# EAGLE design CP2108 (EAGLE 7.2.0)
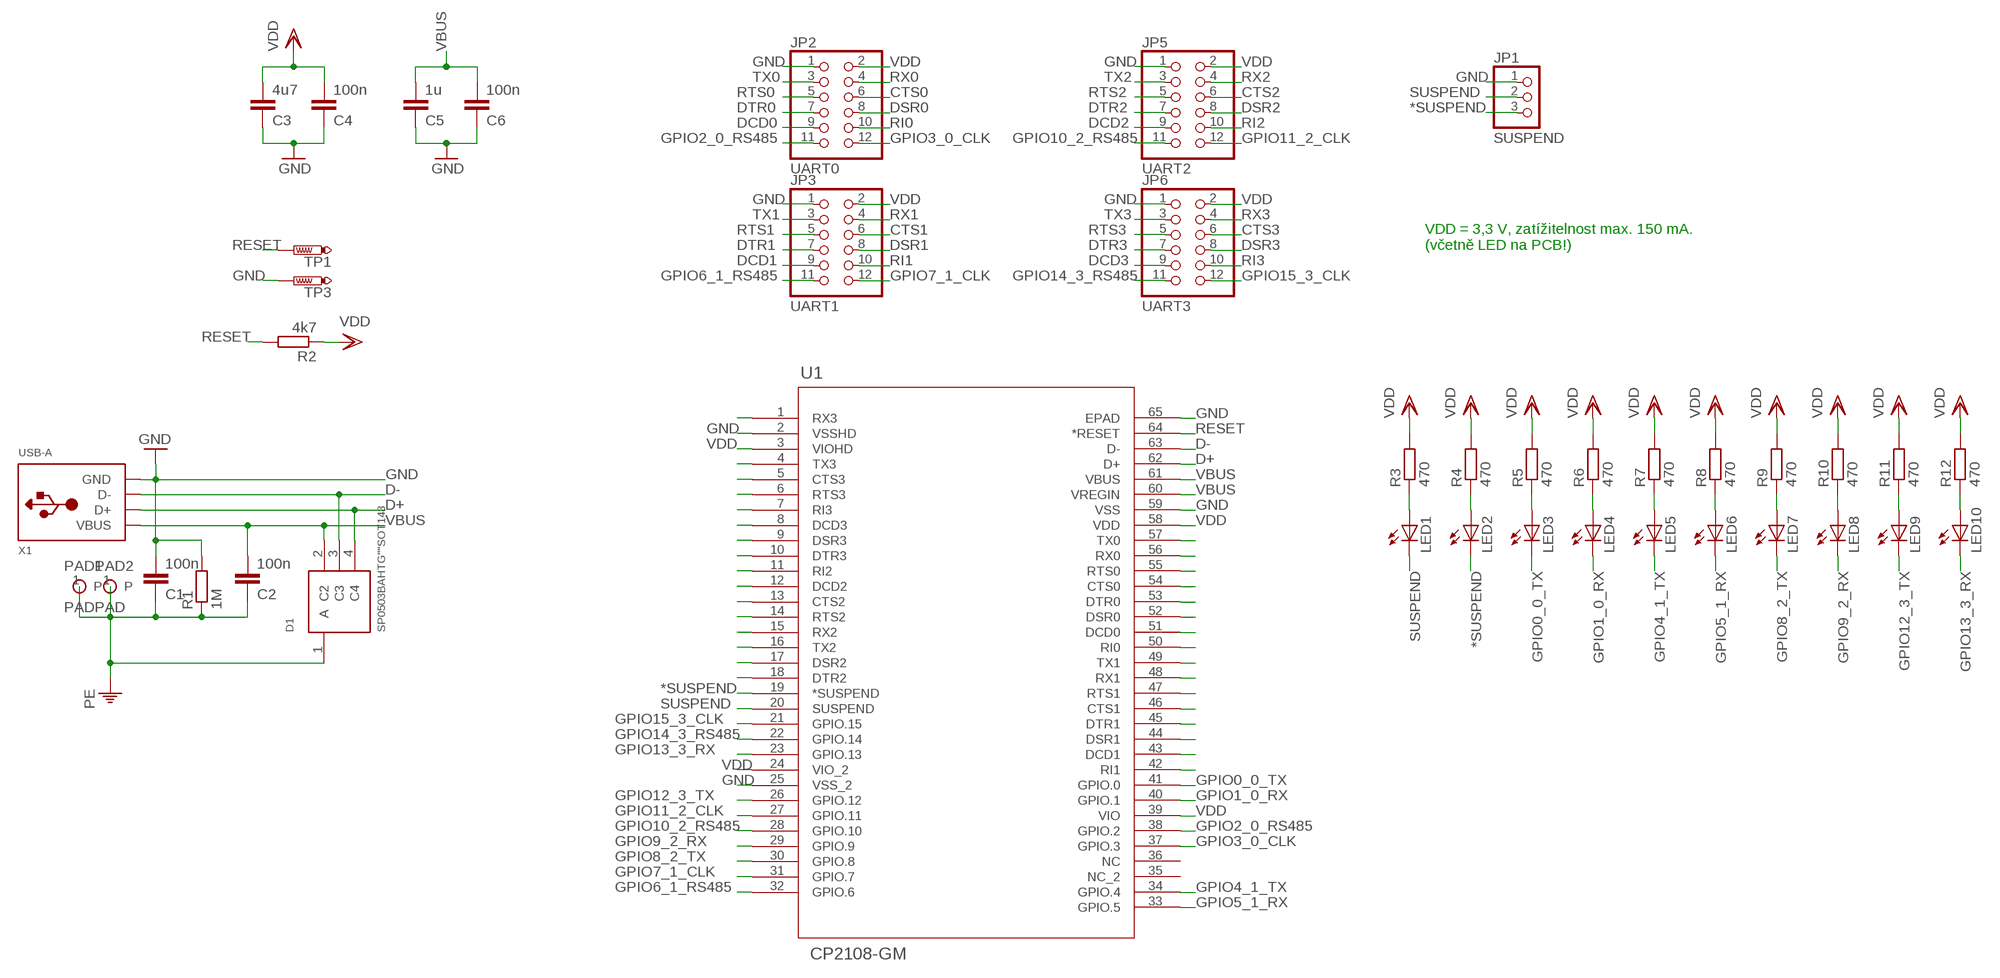
[diagram p0: schematic, sheet 1]

## Parts
C1  100n  C-EUC0603  [C0603]
C2  100n  C-EUC0603  [C0603]
C3  4u7  C-EUC0805  [C0805]
C4  100n  C-EUC0603  [C0603]
C5  1u  C-EUC0805  [C0805]
C6  100n  C-EUC0603  [C0603]
D1  SP0503BAHTG""SOT143  [SOT143]
JP1  SUSPEND  PINHD-1X3  [1X03]
JP2  UART0  PINHD-2X6  [2X06]
JP3  UART1  PINHD-2X6  [2X06]
JP5  UART2  PINHD-2X6  [2X06]
JP6  UART3  PINHD-2X6  [2X06]
LED1  LEDSML0603  [SML0603]
LED2  LEDSML0603  [SML0603]
LED3  LEDSML0603  [SML0603]
LED4  LEDSML0603  [SML0603]
LED5  LEDSML0603  [SML0603]
LED6  LEDSML0603  [SML0603]
LED7  LEDSML0603  [SML0603]
LED8  LEDSML0603  [SML0603]
LED9  LEDSML0603  [SML0603]
LED10  LEDSML0603  [SML0603]
PAD1  PAD  [PAD3]
PAD2  PAD  [PAD3]
R1  1M  R-EU_R0603  [R0603]
R2  4k7  R-EU_R0603  [R0603]
R3  470  R-EU_R0603  [R0603]
R4  470  R-EU_R0603  [R0603]
R5  470  R-EU_R0603  [R0603]
R6  470  R-EU_R0603  [R0603]
R7  470  R-EU_R0603  [R0603]
R8  470  R-EU_R0603  [R0603]
R9  470  R-EU_R0603  [R0603]
R10  470  R-EU_R0603  [R0603]
R11  470  R-EU_R0603  [R0603]
R12  470  R-EU_R0603  [R0603]
TP1  RESET  PTR1B1,27  [B1,27]
TP3  GND  PTR1B1,27  [B1,27]
U1  CP2108-GM  [QFN64]
X1  USB-A  [MOLEX_480371000]

## Nets
*SUSPEND: JP1.3 LED2.C U1.19(*SUSPEND)
CTS0: JP2.6 U1.54(CTS0)
CTS1: JP3.6 U1.46(CTS1)
CTS2: JP5.6 U1.13(CTS2)
CTS3: JP6.6 U1.5(CTS3)
D+: D1.4(C4) U1.62(D+) X1.3(D+)
D-: D1.3(C3) U1.63(D-) X1.2(D-)
DCD0: JP2.9 U1.51(DCD0)
DCD1: JP3.9 U1.43(DCD1)
DCD2: JP5.9 U1.12(DCD2)
DCD3: JP6.9 U1.8(DCD3)
DSR0: JP2.8 U1.52(DSR0)
DSR1: JP3.8 U1.44(DSR1)
DSR2: JP5.8 U1.17(DSR2)
DSR3: JP6.8 U1.9(DSR3)
DTR0: JP2.7 U1.53(DTR0)
DTR1: JP3.7 U1.45(DTR1)
DTR2: JP5.7 U1.18(DTR2)
DTR3: JP6.7 U1.10(DTR3)
GND: C1.2 C3.1 C4.1 C5.1 C6.1 JP1.1 JP2.1 JP3.1 JP5.1 JP6.1 R1.2 TP3.TP U1.2(VSSHD) U1.25(VSS_2) U1.59(VSS) U1.65(EPAD) X1.4(GND)
GPIO0_0_TX: LED3.C U1.41(GPIO.0)
GPIO1_0_RX: LED4.C U1.40(GPIO.1)
GPIO2_0_RS485: JP2.11 U1.38(GPIO.2)
GPIO3_0_CLK: JP2.12 U1.37(GPIO.3)
GPIO4_1_TX: LED5.C U1.34(GPIO.4)
GPIO5_1_RX: LED6.C U1.33(GPIO.5)
GPIO6_1_RS485: JP3.11 U1.32(GPIO.6)
GPIO7_1_CLK: JP3.12 U1.31(GPIO.7)
GPIO8_2_TX: LED7.C U1.30(GPIO.8)
GPIO9_2_RX: LED8.C U1.29(GPIO.9)
GPIO10_2_RS485: JP5.11 U1.28(GPIO.10)
GPIO11_2_CLK: JP5.12 U1.27(GPIO.11)
GPIO12_3_TX: LED9.C U1.26(GPIO.12)
GPIO13_3_RX: LED10.C U1.23(GPIO.13)
GPIO14_3_RS485: JP6.11 U1.22(GPIO.14)
GPIO15_3_CLK: JP6.12 U1.21(GPIO.15)
N$3: LED2.A R4.1
N$5: LED5.A R7.1
N$6: LED1.A R3.1
N$7: LED3.A R5.1
N$10: LED6.A R8.1
N$12: LED7.A R9.1
N$14: LED8.A R10.1
N$16: LED9.A R11.1
N$18: LED10.A R12.1
N$25: LED4.A R6.1
RESET: R2.2 TP1.TP U1.64(*RESET)
RI0: JP2.10 U1.50(RI0)
RI1: JP3.10 U1.42(RI1)
RI2: JP5.10 U1.11(RI2)
RI3: JP6.10 U1.7(RI3)
RTS0: JP2.5 U1.55(RTS0)
RTS1: JP3.5 U1.47(RTS1)
RTS2: JP5.5 U1.14(RTS2)
RTS3: JP6.5 U1.6(RTS3)
RX0: JP2.4 U1.56(RX0)
RX1: JP3.4 U1.48(RX1)
RX2: JP5.4 U1.15(RX2)
RX3: JP6.4 U1.1(RX3)
SHIELD: C1.1 C2.1 D1.1(A) PAD1.1(P) PAD2.1(P) R1.1 ; supply symbol labelled PE
SUSPEND: JP1.2 LED1.C U1.20(SUSPEND)
TX0: JP2.3 U1.57(TX0)
TX1: JP3.3 U1.49(TX1)
TX2: JP5.3 U1.16(TX2)
TX3: JP6.3 U1.4(TX3)
VBUS: C2.2 C5.2 C6.2 D1.2(C2) U1.60(VREGIN) U1.61(VBUS) X1.1(VBUS)
VDD: C3.2 C4.2 JP2.2 JP3.2 JP5.2 JP6.2 R2.1 R3.2 R4.2 R5.2 R6.2 R7.2 R8.2 R9.2 R10.2 R11.2 R12.2 U1.3(VIOHD) U1.24(VIO_2) U1.39(VIO) U1.58(VDD)
Unconnected: U1.35(NC_2) U1.36(NC)

## Notes on the sheet
- VDD = 3,3 V, zatížitelnost max. 150 mA.
  (včetně LED na PCB!)

## Library data of the parts
C1-C6 = rcl:C-EU: CAPACITOR, European symbol
D1 = Littelfuse:SP0503BAHTG: Littelfuse SP0503BAHTG TVS DIODE 5.5VWM 8.5VC SOT143
JP1 = pinhead:PINHD-1X3: PIN HEADER
JP2 JP3 JP5 JP6 = pinhead:PINHD-2X6: PIN HEADER
LED1-LED10 = led:LED: LED OSRAM: - CHIPLED LG R971, LG N971, LY N971, LG Q971, LY Q971, LO R971, LY R971 LH N974, LH R974 LS Q976, LO Q976, LY Q976 LO Q996 - Hyper CHIPLED LW Q18S LB Q993, LB Q99A, LB R99A - SideLED LS A670, LO A670, LY A670, LG A670, LP A670 LB A673, LV A673, LT A673, LW A673 LH A674 LY A675 LS A676, LA A676, LO A676, LY A676, LW A676 LS A679, LY A679, LG A679 - Hyper Micro SIDELED® LS Y876, LA Y876, LO Y876, LY Y876 LT Y87S - SmartLED LW L88C, LW L88S LB L89C, LB L89S, LG L890 LS L89K, LO L89K, LY L89K LS L896, LA L896, LO L896, LY L896 - TOPLED LS T670, LO T670, LY T670, LG T670, LP T670 LSG T670, LSP T670, LSY T670, LOP T670, LYG T670 LG T671, LOG T671, LSG T671 LB T673, LV T673, LT T673, LW T673 LH T674 LS T676, LA T676, LO T676, LY T676, LB T676, LH T676, LSB T676, LW T676 LB T67C, LV T67C, LT T67C, LS T67K, LO T67K, LY T67K, LW E67C LS E67B, LA E67B, LO E67B, LY E67B, LB E67C, LV E67C, LT E67C LW T67C LS T679, LY T679, LG T679 LS T770, LO T770, LY T770, LG T770, LP T770 LB T773, LV T773, LT T773, LW T773 LH T774 LS E675, LA E675, LY E675, LS T675 LS T776, LA T776, LO T776, LY T776, LB T776 LHGB T686 LT T68C, LB T68C - Hyper Mini TOPLED® LB M676 - Mini TOPLED Santana® LG M470 LS M47K, LO M47K, LY M47K Source: http://www.osram.convergy.de LUXEON: - LUMILED® LXK2-PW12-R00, LXK2-PW12-S00, LXK2-PW14-U00, LXK2-PW14-V00 LXK2-PM12-R00, LXK2-PM12-S00, LXK2-PM14-U00 LXK2-PE12-Q00, LXK2-PE12-R00, LXK2-PE12-S00, LXK2-PE14-T00, LXK2-PE14-U00 LXK2-PB12-K00, LXK2-PB12-L00, LXK2-PB12-M00, LXK2-PB14-N00, LXK2-PB14-P00, LXK2-PB14-Q00 LXK2-PR12-L00, LXK2-PR12-M00, LXK2-PR14-Q00, LXK2-PR14-R00 LXK2-PD12-Q00, LXK2-PD12-R00, LXK2-PD12-S00 LXK2-PH12-R00, LXK2-PH12-S00 LXK2-PL12-P00, LXK2-PL12-Q00, LXK2-PL12-R00 Source: www.luxeon.com KINGBRIGHT: KA-3528ASYC Source: www.kingbright.com
PAD1 PAD2 = interconnect:PAD
R1-R12 = rcl:R-EU_: RESISTOR, European symbol
TP1 TP3 = testpad:PTR1: TEST PIN
U1 = Silicon Labs:CP2108-GM; MANUFACTURER_PART_NUMBER: cp2108-gm; VENDOR: Silicon Labs
X1 = adafruit:USB-A: USB type A 'plug' Used for things that can directly connect to a USB port, say USB key

## Net classes
0 default: clearance 0.205 mm

## Board
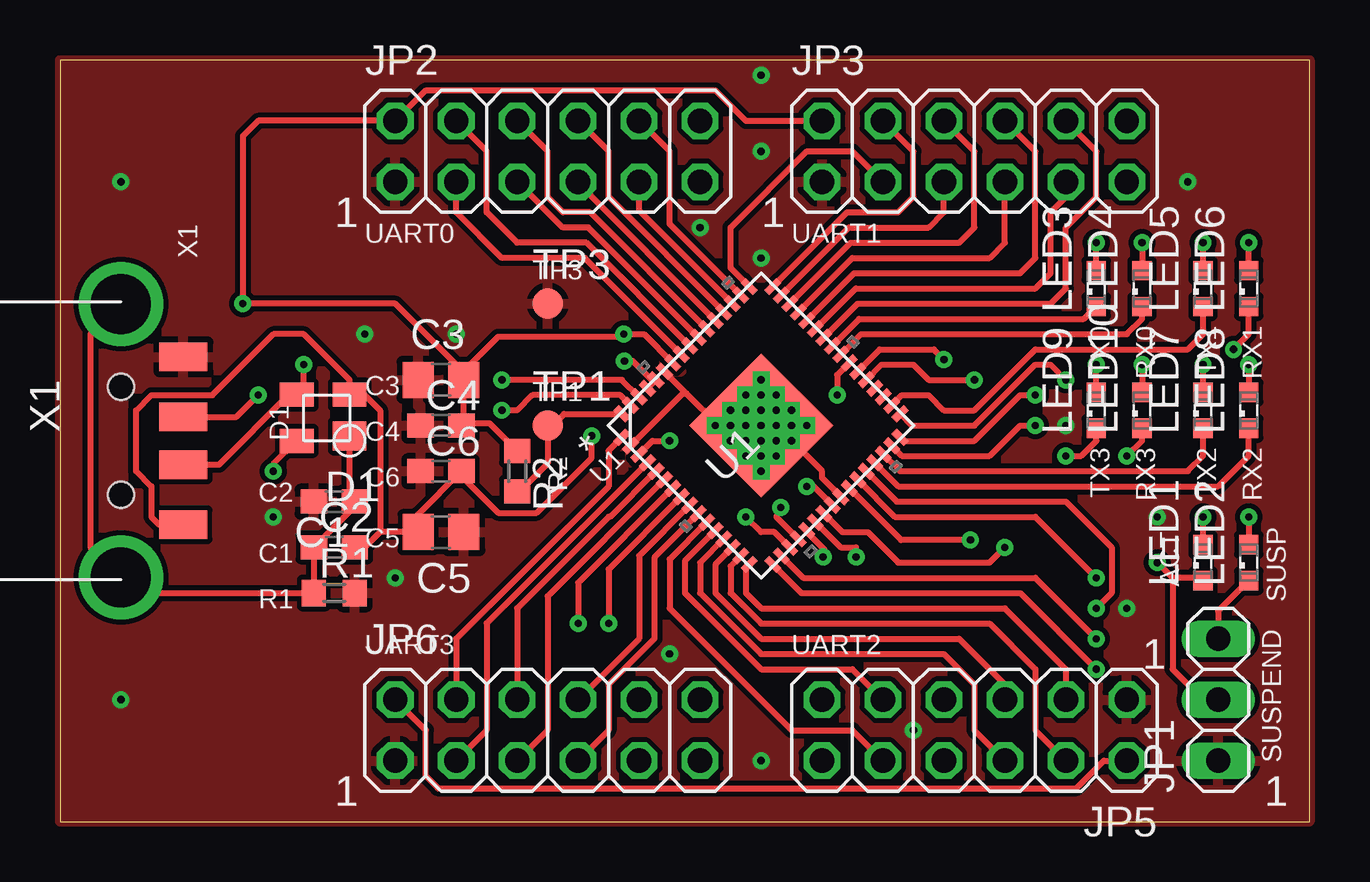
[diagram p1: board, top side]
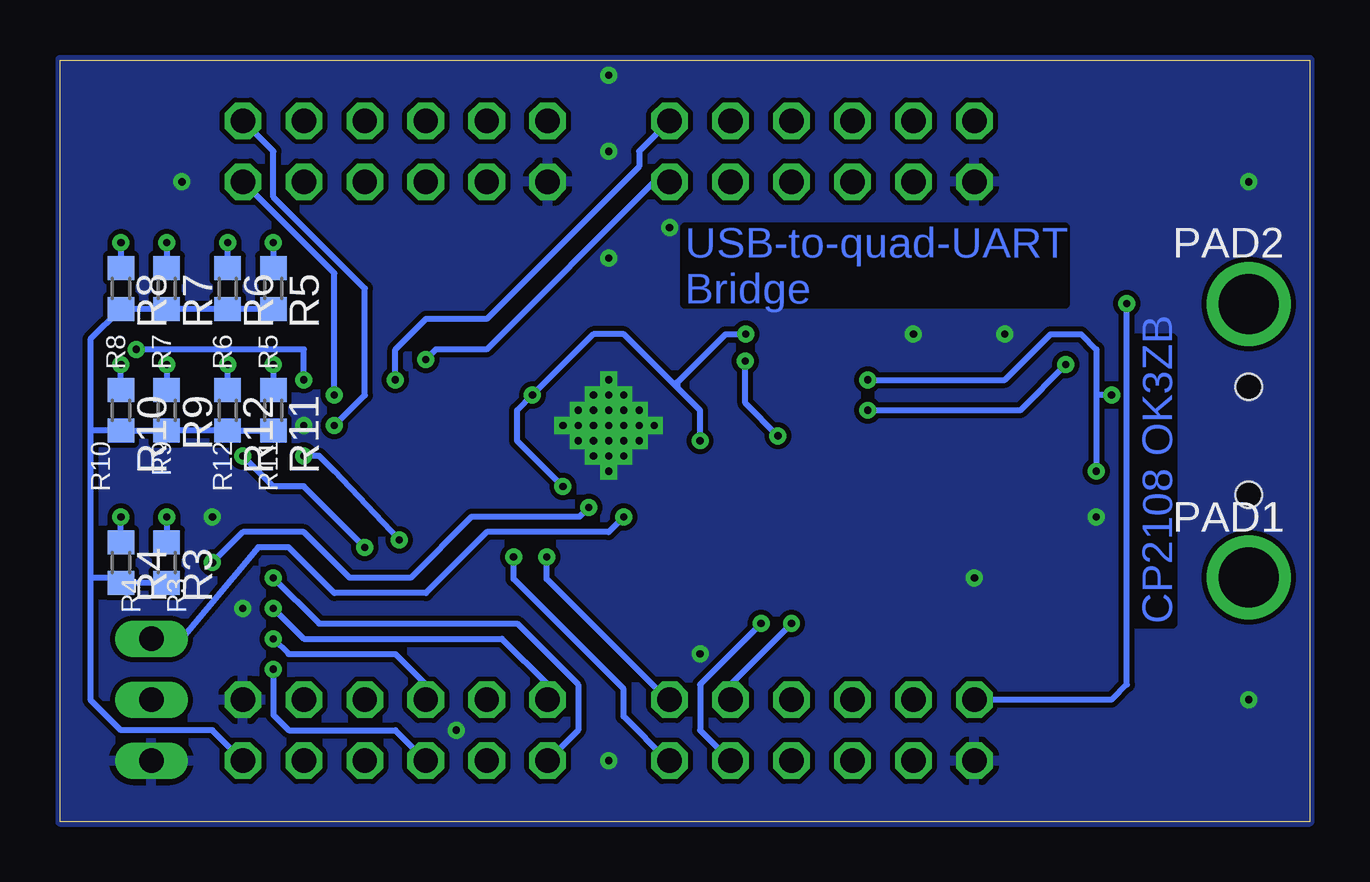
[diagram p2: board, bottom side, seen from below]

Size 52.07 x 31.75 mm. Coordinates in mm from the lower left corner, seen from the top.
Outline: 0,0 52.07,0 52.07,31.75 0,31.75 0,0
Copper layers (1*16): Top 0.035mm / dielectric 1.5mm / Bottom 0.035mm
Design rules "default *": minimum track width 10mil, minimum drill 0.3mm, track to track 6mil, track to pad 6mil, pad to pad 6mil, via to via 6mil, smd to smd 6mil, copper to edge 0mil, drill to drill 8mil, minimum pad ring 10mil, minimum via ring 8mil, stop-mask expansion 4mil, vias tented up to drill 0mil, thermal gap 10mil
tRestrict: area 24.1,11.4 to 34.3,21.6

### Footprints (pad centres in the part's own frame; a part is rotated, then mirrored left to right if it is on the bottom)
C0603 = smd 1.1 x 1: 1 -0.85,0; 2 0.85,0
C0805 = smd 1.3 x 1.5: 1 -0.95,0; 2 0.95,0
SOT143 = smd 1.2 x 1.4: 1 -1.07,-1.27 | smd 1 x 1.4: 2 0.65,-1.27; 3 0.65,0.93; 4 -1.27,0.93
1X03 = drill 1.016 long: 1 -2.54,0; 2 0,0; 3 2.54,0
2X06 = drill 1.016 octagon: 1 -6.35,-1.27; 2 -6.35,1.27; 3 -3.81,-1.27; 4 -3.81,1.27; 5 -1.27,-1.27; 6 -1.27,1.27; 7 1.27,-1.27; 8 1.27,1.27; 9 3.81,-1.27; 10 3.81,1.27; 11 6.35,-1.27; 12 6.35,1.27
SML0603 = smd 0.8 x 0.8: A 0.75,0; C -0.75,0
PAD3 = drill 0.8 pad 3 octagon: 1 0,0
R0603 = smd 1 x 1.1: 1 -0.85,0; 2 0.85,0
B1,27 = smd 1.27 x 1.27: TP 0,0
QFN64 = smd 0.711 x 0.305: 1 -4.445,3.75; 2 -4.445,3.25; 3 -4.445,2.75; 4 -4.445,2.25; 5 -4.445,1.75; 6 -4.445,1.25; 7 -4.445,0.75; 8 -4.445,0.25; 9 -4.445,-0.25; 10 -4.445,-0.75; 11 -4.445,-1.25; 12 -4.445,-1.75; 13 -4.445,-2.25; 14 -4.445,-2.75; 15 -4.445,-3.25; 16 -4.445,-3.75; 33 4.445,-3.75; 34 4.445,-3.25; 35 4.445,-2.75; 36 4.445,-2.25; 37 4.445,-1.75; 38 4.445,-1.25; 39 4.445,-0.75; 40 4.445,-0.25; 41 4.445,0.25; 42 4.445,0.75; 43 4.445,1.25; 44 4.445,1.75; 45 4.445,2.25; 46 4.445,2.75; 47 4.445,3.25; 48 4.445,3.75 | smd 0.305 x 0.711: 17 -3.75,-4.445; 18 -3.25,-4.445; 19 -2.75,-4.445; 20 -2.25,-4.445; 21 -1.75,-4.445; 22 -1.25,-4.445; 23 -0.75,-4.445; 24 -0.25,-4.445; 25 0.25,-4.445; 26 0.75,-4.445; 27 1.25,-4.445; 28 1.75,-4.445; 29 2.25,-4.445; 30 2.75,-4.445; 31 3.25,-4.445; 32 3.75,-4.445; 49 3.75,4.445; 50 3.25,4.445; 51 2.75,4.445; 52 2.25,4.445; 53 1.75,4.445; 54 1.25,4.445; 55 0.75,4.445; 56 0.25,4.445; 57 -0.25,4.445; 58 -0.75,4.445; 59 -1.25,4.445; 60 -1.75,4.445; 61 -2.25,4.445; 62 -2.75,4.445; 63 -3.25,4.445; 64 -3.75,4.445 | smd 4.242 x 4.242: 65 0,0
MOLEX_480371000 = smd 1.2 x 2: 1 3.5,2.6; 2 1,2.6; 3 -1,2.6; 4 -3.5,2.6 | drill 2.5: M1 -5.7,0; M2 5.7,0 | hole 1.1: -2.25,0; 2.25,0

### Placement (x,y rotation side)
C1  11.43,13.34 180 top
C2  11.43,11.43 0 top
C3  15.88,18.41 0 top
C4  15.88,16.51 0 top
C5  15.88,12.06 180 top
C6  15.88,14.61 0 top
D1  10.79,17.14 90 top
JP1  48.26,5.08 90 top
JP2  20.32,27.94 0 top
JP3  38.1,27.94 0 top
JP5  38.1,3.81 180 top
JP6  20.32,3.81 0 top
LED1  47.62,10.79 90 top
LED2  49.53,10.79 90 top
LED3  43.18,22.23 90 top
LED4  45.09,22.23 90 top
LED5  47.62,22.23 90 top
LED6  49.53,22.23 90 top
LED7  47.62,17.14 90 top
LED8  49.53,17.14 90 top
LED9  43.18,17.14 90 top
LED10  45.09,17.14 90 top
PAD1  2.54,10.16 0 top
PAD2  2.54,21.59 0 top
R1  11.43,9.53 0 top
R2  19.05,14.61 270 top
R3  47.62,10.79 270 bottom
R4  49.53,10.79 270 bottom
R5  43.18,22.23 270 bottom
R6  45.09,22.23 270 bottom
R7  47.62,22.23 270 bottom
R8  49.53,22.23 270 bottom
R9  47.62,17.14 270 bottom
R10  49.53,17.14 270 bottom
R11  43.18,17.14 270 bottom
R12  45.09,17.14 270 bottom
TP1  20.32,16.51 0 top
TP3  20.32,21.59 0 top
U1  29.21,16.51 45 top
X1  2.54,15.88 270 top

### Tracks (layer width: path | path; a pad name or v marks a point on that pad's centre or on a via)
*SUSPEND  (via drill 0.3)
  Top 0.254: U1.19 29.77,12.06 29.21,12.06 v28.57,12.7 | LED2.C 48.26,8.78 JP1.3
  Bottom 0.254: v28.57,12.7 29.21,12.06 34.29,12.06 36.83,9.53 40.64,9.53 42.55,11.43 43.81,11.43 46.99,7.62 JP1.3
CTS0
  Top 0.254: U1.54 22.09,25.4 20.95,25.4 20.32,26.04 20.32,27.94 JP2.6
CTS1
  Top 0.254: U1.46 32.94,24.13 37.47,24.13 38.1,24.77 38.1,27.94 JP3.6
CTS2
  Top 0.254: U1.13 26.67,10.79 26.67,9.53 29.21,6.99 36.83,6.99 38.1,5.71 38.1,3.81 JP5.6
CTS3
  Top 0.254: U1.5 22.93,12.7 22.86,12.7 19.05,8.89 JP6.6
D+  (via drill 0.3)
  Top 0.254: v8.89,14.61 8.89,14.9 D1.4 | U1.62 23.42,18.41 v18.41,18.41 | X1.3 7.35,16.88 v8.26,17.78
  Bottom 0.254: v18.41,18.41 12.7,18.41 10.79,20.32 9.53,20.32 8.89,19.68 8.89,17.78 | 8.89,17.78 v8.89,14.61 | v8.26,17.78 8.89,17.78
D-  (via drill 0.3)
  Top 0.254: v10.16,19.05 10.16,18.09 D1.3 9.54,17.8 6.62,14.88 X1.2 | U1.63 23.34,17.78 19.68,17.78 19.05,17.14 v18.41,17.14
  Bottom 0.254: v10.16,19.05 12.06,17.14 v18.41,17.14
DCD0
  Top 0.254: U1.51 24.13,25.48 JP2.9
DCD1
  Top 0.254: U1.43 33.16,22.23 40.64,22.23 41.27,22.86 41.27,25.4 41.91,26.04 JP3.9
DCD2
  Top 0.254: U1.12 26.04,10.86 26.04,9.53 29.21,6.35 33.02,6.35 JP5.9
DCD3  (via drill 0.3)
  Top 0.254: U1.8 22.86,10.51 v22.86,8.26
  Bottom 0.254: v22.86,8.26 25.4,5.71 25.4,3.81 JP6.9
DSR0
  Top 0.254: U1.52 22.86,26.04 22.86,27.94 JP2.8
DSR1
  Top 0.254: U1.44 33.09,22.86 40.01,22.86 40.64,23.5 40.64,27.94 JP3.8
DSR2  (via drill 0.3)
  Top 0.254: U1.17 30.89,9.53 40.01,9.53 v43.18,6.35
  Bottom 0.254: v43.18,6.35 43.18,4.45 42.55,3.81 38.1,3.81 JP5.8
DSR3
  Top 0.254: U1.9 24.13,11.08 24.13,7.62 JP6.8
DTR0
  Top 0.254: U1.53 21.59,26.61 JP2.7
DTR1
  Top 0.254: U1.45 33.01,23.5 38.73,23.5 39.37,24.13 JP3.7
DTR2  (via drill 0.3)
  Top 0.254: U1.18 30.96,10.16 40.64,10.16 v43.18,7.62
  Bottom 0.254: v43.18,7.62 42.55,6.99 38.1,6.99 36.83,5.71 JP5.7
DTR3
  Top 0.254: JP6.7 22.86,3.81 22.86,5.71 24.77,7.62 24.77,11 U1.10
GND  (via drill 0.3)
  Top 0.254: 29.56,16.51 U1.65 | U1.2 25.95,17.85 26.1,17.85 | U1.25 31.75,14.32 31.75,14.61 v29.84,16.51 U1.65 | U1.59 26.1,17.85 | 26.1,17.85 27.44,16.51 v27.94,16.51 U1.65
  other vias: 12.7,20.32 29.21,16.51 8.89,12.7 13.97,10.16 29.21,15.24 30.48,16.51 29.21,17.78 29.21,23.5 28.57,16.51 29.21,17.14 28.57,17.14 27.94,17.14 28.57,17.78 29.21,18.41 29.84,17.14 29.84,17.78 30.48,17.14 31.11,16.51 30.48,15.88 29.84,15.24 29.84,15.88 29.21,15.88 28.57,15.24 27.94,15.88 28.57,15.88 27.3,16.51 29.21,14.61 44.45,8.89 45.72,12.7 46.99,26.67 2.54,26.67 29.21,31.11 29.21,2.54 25.4,6.99 35.56,3.81 41.91,16.51 2.54,5.08 16.51,20.32 29.21,27.94 26.67,24.77
  pour Top: 0,31.75 52.07,31.75 52.07,0 0,0
  pour Bottom: 0,31.75 52.07,31.75 52.07,0 0,0
GPIO0_0_TX
  Top 0.254: U1.41 33.3,20.95 42.66,20.95 LED3.C
GPIO1_0_RX
  Top 0.254: U1.40 33.37,20.32 44.45,20.32 45.09,20.95 LED4.C
GPIO2_0_RS485  (via drill 0.3)
  Top 0.254: U1.38 34.15,19.68 36.41,19.68 v36.83,19.26
  Bottom 0.254: v36.83,19.26 36.41,19.68 34.29,19.68 27.3,26.67 JP2.11
GPIO3_0_CLK  (via drill 0.3)
  Top 0.254: U1.37 34.23,19.05 35.56,19.05 36.2,18.41 v38.1,18.41
  Bottom 0.254: v38.1,18.41 38.1,19.68 36.83,20.95 34.29,20.95 27.94,27.3 27.94,27.94 JP2.12
GPIO4_1_TX
  Top 0.254: U1.34 35.08,17.78 36.2,17.78 36.83,17.14 38.1,17.14 40.64,19.68 46.99,19.68 47.62,20.32 LED5.C
GPIO5_1_RX  (via drill 0.3)
  Top 0.254: U1.33 35.5,16.51 38.1,16.51 40.64,19.05 41.27,19.05 v41.91,18.41 | v48.9,19.68 49.53,20.32 LED6.C
  Bottom 0.254: v41.91,18.41 41.91,19.68 v48.9,19.68
GPIO6_1_RS485  (via drill 0.3)
  Top 0.254: U1.32 35.15,15.88 38.1,15.88 40.01,17.78 v40.64,17.78
  Bottom 0.254: v40.64,17.78 40.64,22.86 JP3.11
GPIO7_1_CLK  (via drill 0.3)
  Top 0.254: U1.31 35.08,15.24 38.73,15.24 40.01,16.51 v40.64,16.51
  Bottom 0.254: v40.64,16.51 39.37,17.78 39.37,22.23 43.18,26.04 43.18,27.94 JP3.12
GPIO8_2_TX
  Top 0.254: U1.30 35,14.61 46.99,14.61 47.62,15.24 LED7.C
GPIO9_2_RX
  Top 0.254: U1.29 34.93,13.97 48.26,13.97 49.53,15.24 LED8.C
GPIO10_2_RS485  (via drill 0.3)
  Top 0.254: U1.28 34.86,13.34 41.91,13.34 43.81,11.43 43.81,9.53 v43.18,8.89
  Bottom 0.254: v43.18,8.89 41.91,7.62 33.66,7.62 31.75,5.71 JP5.11
GPIO11_2_CLK  (via drill 0.3)
  Top 0.254: U1.27 34.79,12.7 40.64,12.7 v43.18,10.16
  Bottom 0.254: v43.18,10.16 41.27,8.26 33.02,8.26 30.48,5.71 30.48,3.81 JP5.12
GPIO12_3_TX  (via drill 0.3)
  Top 0.254: U1.26 35.05,11.73 v37.94,11.73 | LED9.C 43.18,15.88 42.55,15.24 v41.91,15.24
  Bottom 0.254: v37.94,11.73 40.64,14.61 41.27,15.24 v41.91,15.24
GPIO13_3_RX  (via drill 0.3)
  Top 0.254: U1.23 32.59,12.06 33.66,12.06 34.92,10.79 38.73,10.79 v39.37,11.43 | v44.45,15.24 45.09,15.88 LED10.C
  Bottom 0.254: v39.37,11.43 41.91,13.97 43.18,13.97 v44.45,15.24
GPIO14_3_RS485  (via drill 0.3)
  Top 0.254: U1.22 32.52,11.43 33.17,11.43 v33.17,11.03
  Bottom 0.254: v33.17,11.03 33.17,10.11 28.58,5.52 28.58,4.38 26.74,2.54 JP6.11
GPIO15_3_CLK  (via drill 0.3)
  Top 0.254: U1.21 31.12,12.06 31.86,11.32 31.79,11.26 v31.79,11.03
  Bottom 0.254: v31.79,11.03 31.79,10.11 26.74,5.06 JP6.12
N$3  (via drill 0.3)
  Top 0.254: v49.53,12.7 LED2.A
  Bottom 0.254: R4.1 v49.53,12.7
N$5  (via drill 0.3)
  Top 0.254: LED5.A v47.62,24.13
  Bottom 0.254: v47.62,24.13 R7.1
N$6  (via drill 0.3)
  Top 0.254: LED1.A v47.62,12.7
  Bottom 0.254: v47.62,12.7 R3.1
N$7  (via drill 0.3)
  Top 0.254: LED3.A v43.18,24.13
  Bottom 0.254: v43.18,24.13 R5.1
N$10  (via drill 0.3)
  Top 0.254: LED6.A v49.53,24.13
  Bottom 0.254: v49.53,24.13 R8.1
N$12  (via drill 0.3)
  Top 0.254: LED7.A v47.62,19.05
  Bottom 0.254: v47.62,19.05 R9.1
N$14  (via drill 0.3)
  Top 0.254: v49.53,19.05 LED8.A
  Bottom 0.254: R10.1 v49.53,19.05
N$16  (via drill 0.3)
  Top 0.254: LED9.A v43.18,19.05
  Bottom 0.254: v43.18,19.05 R11.1
N$18  (via drill 0.3)
  Top 0.254: v45.09,19.05 LED10.A
  Bottom 0.254: R12.1 v45.09,19.05
N$25  (via drill 0.3)
  Top 0.254: v45.09,24.13 LED4.A
  Bottom 0.254: R6.1 v45.09,24.13
RESET
  Top 0.254: U1.64 23.3,17 21.01,17 20.55,16.54 TP1.TP 20.32,16.31 20.32,14.93 19.17,13.79 R2.2
RI0
  Top 0.254: U1.50 25.4,24.92 25.4,27.94 JP2.10
RI1
  Top 0.254: U1.42 33.23,21.59 41.27,21.59 41.91,22.23 41.91,24.77 43.18,26.04 43.18,27.94 JP3.10
RI2
  Top 0.254: U1.11 25.4,10.93 25.4,8.89 30.48,3.81 33.02,3.81 JP5.10
RI3  (via drill 0.3)
  Top 0.254: U1.7 21.59,9.95 v21.59,8.26
  Bottom 0.254: v21.59,8.26 24.13,5.71 JP6.10
RTS0
  Top 0.254: U1.55 22.02,24.77 20.95,24.77 JP2.5
RTS1
  Top 0.254: U1.47 32.87,24.77 36.2,24.77 36.83,25.4 JP3.5
RTS2
  Top 0.254: U1.14 27.3,10.72 27.3,9.53 29.21,7.62 37.47,7.62 39.37,5.71 JP5.5
RTS3
  Top 0.254: JP6.5 20.32,3.81 20.32,9.39 U1.6
RX0
  Top 0.254: U1.56 21.94,24.13 19.05,24.13 17.78,25.4 17.78,27.94 JP2.4
RX1
  Top 0.254: U1.48 32.8,25.4 34.92,25.4 35.56,26.04 35.56,27.94 JP3.4
RX2
  Top 0.254: U1.15 27.94,10.64 27.94,9.53 29.21,8.26 38.73,8.26 40.64,6.35 40.64,3.81 JP5.4
RX3
  Top 0.254: U1.1 22.86,15.46 22.86,13.97 16.51,7.62 JP6.4
SHIELD
  Top 0.254: D1.1 12.06,13.55 C1.1 12.28,13.13 C2.1 R1.1 3.17,9.53 PAD1.1 1.27,11.43 1.27,20.32 PAD2.1
SUSPEND  (via drill 0.3)
  Top 0.254: U1.20 29.84,12.69 v30.03,13.1 | 46.35,10.16 46.35,6.35 47.62,5.08 JP1.2 | v45.72,10.79 46.35,10.16 | LED1.C 47.51,10.16 46.35,10.16
  Bottom 0.254: v30.03,13.1 30.43,12.7 34.92,12.7 37.47,10.16 40.01,10.16 41.91,12.06 44.45,12.06 v45.72,10.79
TX0
  Top 0.254: U1.57 21.87,23.5 18.41,23.5 16.51,25.4 JP2.3
TX1
  Top 0.254: U1.49 27.94,23.08 27.94,24.77 31.11,27.94 33.02,27.94 JP3.3
TX2
  Top 0.254: U1.16 28.57,10.57 28.57,9.53 29.21,8.89 39.37,8.89 41.91,6.35 JP5.3
TX3
  Top 0.254: JP6.3 17.78,3.81 17.78,8.26 U1.4
VBUS  (via drill 0.3)
  Top 0.254: 13.34,12.06 C5.2 14.93,12.8 C6.2 16.65,14.47 18.25,12.87 19.86,12.87 22.15,15.16 v22.15,16.08 | U1.61 U1.60 24.68,18.38 23.86,19.2 v23.52,19.2 | 13.34,12.06 13.34,17.14 12.69,17.8 D1.2 12.06,18.41 10.16,20.32 8.89,20.32 6.35,17.78 3.81,17.78 3.17,17.14 3.17,14.61 3.81,13.97 3.81,12.7 4.13,12.38 X1.1 | C2.2 12.7,11.43 13.34,12.06
  Bottom 0.254: v22.15,16.08 23.52,17.44 v23.52,19.2
VDD  (via drill 0.3)
  Top 0.254: C4.2 16.82,16.61 | 16.82,16.61 C3.2 | C3.2 16.82,18.73 13.97,21.59 v7.62,21.59 7.62,28.57 8.26,29.21 JP2.2 15.24,30.48 27.3,30.48 28.57,29.21 JP3.2 | 16.82,16.61 17.89,16.61 R2.1 19.36,15.76 | U1.58 24.34,20.32 v23.5,20.32 23.3,20.21 18.25,20.21 16.88,18.83 C3.2 | U1.3 24.69,15.88 v25.4,15.88 | JP6.2 15.24,3.81 15.24,1.91 15.74,1.41 15.73,1.39 42.35,1.39 43.5,2.54 JP5.2 | U1.39 32.38,18.62 v32.38,17.78 | U1.24 31.4,13.97 v31.11,13.97
  Bottom 0.254: v7.62,21.59 7.62,5.71 8.26,5.08 JP6.2 | v23.5,20.32 24.34,20.32 26.35,18.31 26.35,18.1 | v25.4,15.88 25.54,16.01 25.4,16.15 25.4,17.14 26.35,18.1 | R5.2 R6.2 R7.2 R8.2 50.8,20.11 50.8,16.3 | R11.2 R12.2 45.51,16.3 | JP5.2 45.72,3.81 49.53,3.81 50.8,5.08 50.8,10.16 | 50.8,16.3 50.8,10.16 | 49.53,9.73 R4.2 | R3.2 R4.2 | R4.2 49.74,10.16 50.8,10.16 | 45.51,16.3 45.51,16.51 | 45.51,16.3 R9.2 R10.2 50.8,16.3 | 26.35,18.1 28.57,20.32 29.84,20.32 v32.38,17.78 33.02,17.14 33.02,15.88 v31.11,13.97

### Text on the board
Bottom: USB-to-quad-UART / Bridge | CP2108 OK3ZB
_tNames: 1 | 1 | UART0 | UART1 | X1 | TP3 | TX0 | RX0 | TX1 | RX1 | C3 | TP1 | D1 | C4 | TX3 | RX3 | TX2 | RX2 | R2 | C6 | U1 | C2 | C1 | C5 | ACT | R1 | SUSP | UART3 | UART2 | 1 | SUSPEND | 1 | 1
_bNames: R5 | R6 | R7 | R8 | R11 | R12 | R9 | R10 | R3 | R4